# Altium schematic sheet Connectors and Mechanical.SchDoc: Connectors and Mechanical
size Letter; Date: 2017-01-08; DocumentNumber: 7; Revision: A; SheetNumber: 7; SheetTotal: 7; ProjectTitle: SDRdrum Arty Shield; PageSetup: Record=PageOptions|CenterHorizontal=True|CenterVertical=True|PrintScale=0.98|XCorrection=1.00|YCorrection=1.00|PrintKind=2|BorderSize=5000000|LeftOffset=0|BottomOffset=0|Orientation=2|PaperLength=1000|PaperWidth=1000|Scale=100|PaperSource=7|PrintQuality=-3|MediaType=1|DitherType=10|PrintScaleMode=1|PaperKind=Tabloid|PaperIndex=3
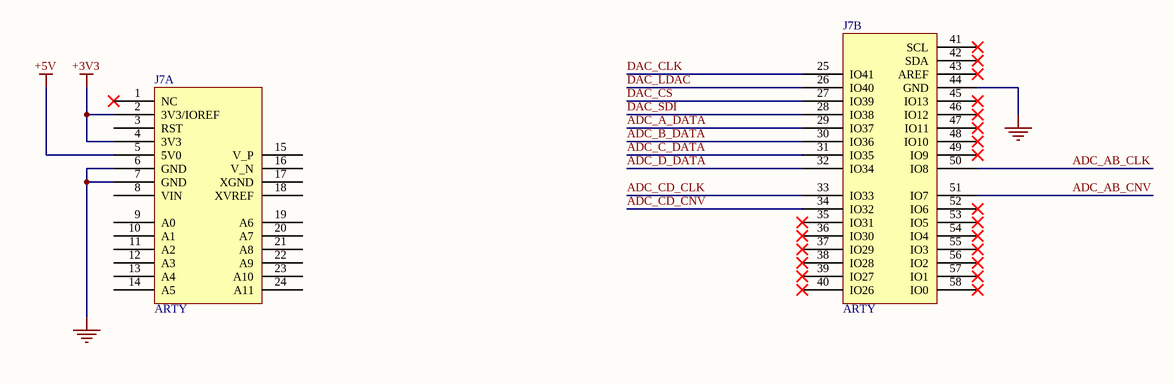
[diagram p0: Connectors and Mechanical.SchDoc]

## Parts
J7  ARTY  [ARTY-TH]  (parts A,B of 2)

## Nets
+3V3: J7.2(3V3/IOREF) J7.4(3V3)
+5V: J7.5(5V0)
GND: J7.6(GND) J7.7(GND) J7.44(GND)
ADC_A_DATA: J7.29(IO37)
ADC_AB_CLK: J7.50(IO8)
ADC_AB_CNV: J7.51(IO7)
ADC_B_DATA: J7.30(IO36)
ADC_C_DATA: J7.31(IO35)
ADC_CD_CLK: J7.33(IO33)
ADC_CD_CNV: J7.34(IO32)
ADC_D_DATA: J7.32(IO34)
DAC_CLK: J7.25(IO41)
DAC_CS: J7.27(IO39)
DAC_LDAC: J7.26(IO40)
DAC_SDI: J7.28(IO38)

Not connected (* = marked no-connect by the designer): J7 1(NC)* 3(RST) 8(VIN) 9(A0) 10(A1) 11(A2) 12(A3) 13(A4) 14(A5) 15(V_P) 16(V_N) 17(XGND) 18(XVREF) 19(A6) 20(A7) 21(A8) 22(A9) 23(A10) 24(A11) 35(IO31)* 36(IO30)* 37(IO29)* 38(IO28)* 39(IO27)* 40(IO26)* 41(SCL)* 42(SDA)* 43(AREF)* 45(IO13)* 46(IO12)* 47(IO11)* 48(IO10)* 49(IO9)* 52(IO6)* 53(IO5)* 54(IO4)* 55(IO3)* 56(IO2)* 57(IO1)* 58(IO0)*

## Notes on the sheet
- Date:
- Revision:
- Sheet:
- /